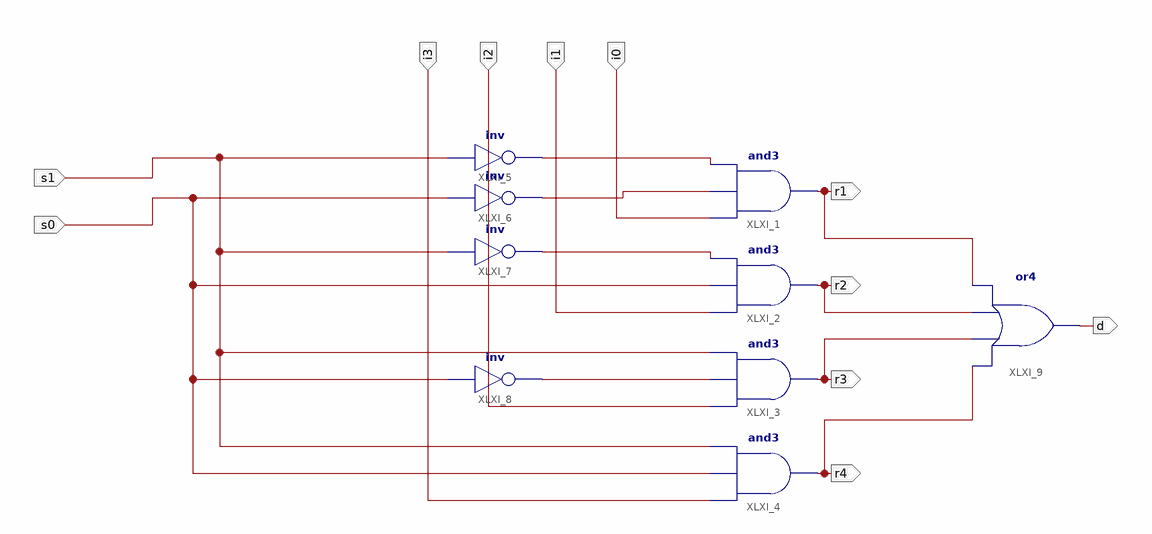
[diagram p0: schematic sheet 1]
// Xilinx ISE schematic MuxSch.sch (spartan3e) as structural Verilog: 9 symbols, 11 ports
module MuxSch (
  input  i0,
  input  i1,
  input  i2,
  input  i3,
  input  s1,
  input  s0,
  output r1,
  output r2,
  output r3,
  output r4,
  output d
);

  wire XLXN_11, XLXN_12, XLXN_13, XLXN_14;

  and XLXI_1 (r1, i0, XLXN_12, XLXN_11);
  and XLXI_2 (r2, i1, s0, XLXN_13);
  and XLXI_3 (r3, i2, XLXN_14, s1);
  and XLXI_4 (r4, i3, s0, s1);
  not XLXI_5 (XLXN_11, s1);
  not XLXI_6 (XLXN_12, s0);
  not XLXI_7 (XLXN_13, s1);
  not XLXI_8 (XLXN_14, s0);
  or XLXI_9 (d, r4, r3, r2, r1);
endmodule
